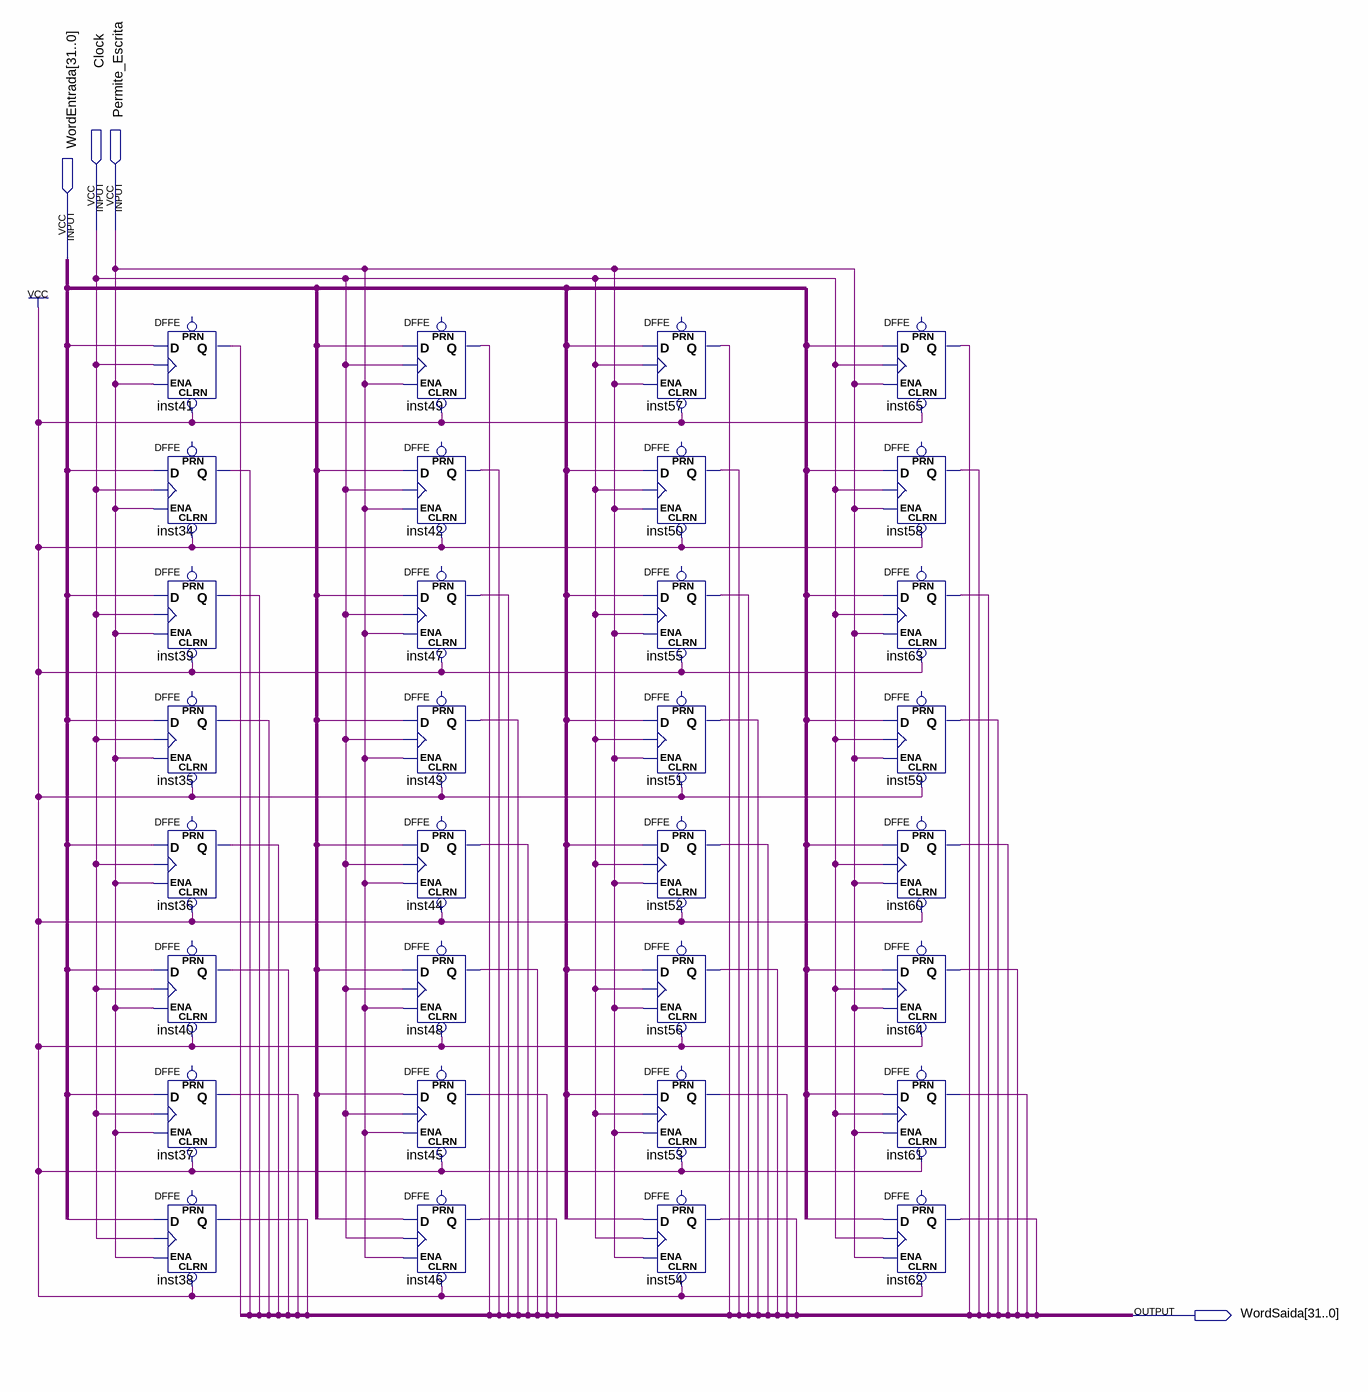
[diagram p0: schematic sheet]
// Quartus schematic registrador32.bdf as structural Verilog: 32 symbols, 4 pins
module registrador32 (
  input  Clock,
  input  Permite_Escrita,
  input  [31:0] WordEntrada,
  output [31:0] WordSaida
);

  DFFE inst41 (.CLRN(1'b1), .D(WordEntrada[0]), .CLK(Clock), .ENA(Permite_Escrita), .Q(WordSaida[0]));  // open: PRN
  DFFE inst34 (.CLRN(1'b1), .D(WordEntrada[1]), .CLK(Clock), .ENA(Permite_Escrita), .Q(WordSaida[1]));  // open: PRN
  DFFE inst39 (.CLRN(1'b1), .D(WordEntrada[2]), .CLK(Clock), .ENA(Permite_Escrita), .Q(WordSaida[2]));  // open: PRN
  DFFE inst35 (.CLRN(1'b1), .D(WordEntrada[3]), .CLK(Clock), .ENA(Permite_Escrita), .Q(WordSaida[3]));  // open: PRN
  DFFE inst36 (.CLRN(1'b1), .D(WordEntrada[4]), .CLK(Clock), .ENA(Permite_Escrita), .Q(WordSaida[4]));  // open: PRN
  DFFE inst40 (.CLRN(1'b1), .D(WordEntrada[5]), .CLK(Clock), .ENA(Permite_Escrita), .Q(WordSaida[5]));  // open: PRN
  DFFE inst37 (.CLRN(1'b1), .D(WordEntrada[6]), .CLK(Clock), .ENA(Permite_Escrita), .Q(WordSaida[6]));  // open: PRN
  DFFE inst38 (.CLRN(1'b1), .D(WordEntrada[7]), .CLK(Clock), .ENA(Permite_Escrita), .Q(WordSaida[7]));  // open: PRN
  DFFE inst49 (.CLRN(1'b1), .D(WordEntrada[8]), .CLK(Clock), .ENA(Permite_Escrita), .Q(WordSaida[8]));  // open: PRN
  DFFE inst42 (.CLRN(1'b1), .D(WordEntrada[9]), .CLK(Clock), .ENA(Permite_Escrita), .Q(WordSaida[9]));  // open: PRN
  DFFE inst47 (.CLRN(1'b1), .D(WordEntrada[10]), .CLK(Clock), .ENA(Permite_Escrita), .Q(WordSaida[10]));  // open: PRN
  DFFE inst43 (.CLRN(1'b1), .D(WordEntrada[11]), .CLK(Clock), .ENA(Permite_Escrita), .Q(WordSaida[11]));  // open: PRN
  DFFE inst44 (.CLRN(1'b1), .D(WordEntrada[12]), .CLK(Clock), .ENA(Permite_Escrita), .Q(WordSaida[12]));  // open: PRN
  DFFE inst48 (.CLRN(1'b1), .D(WordEntrada[13]), .CLK(Clock), .ENA(Permite_Escrita), .Q(WordSaida[13]));  // open: PRN
  DFFE inst45 (.CLRN(1'b1), .D(WordEntrada[14]), .CLK(Clock), .ENA(Permite_Escrita), .Q(WordSaida[14]));  // open: PRN
  DFFE inst46 (.CLRN(1'b1), .D(WordEntrada[15]), .CLK(Clock), .ENA(Permite_Escrita), .Q(WordSaida[15]));  // open: PRN
  DFFE inst57 (.CLRN(1'b1), .D(WordEntrada[16]), .CLK(Clock), .ENA(Permite_Escrita), .Q(WordSaida[16]));  // open: PRN
  DFFE inst50 (.CLRN(1'b1), .D(WordEntrada[17]), .CLK(Clock), .ENA(Permite_Escrita), .Q(WordSaida[17]));  // open: PRN
  DFFE inst55 (.CLRN(1'b1), .D(WordEntrada[18]), .CLK(Clock), .ENA(Permite_Escrita), .Q(WordSaida[18]));  // open: PRN
  DFFE inst51 (.CLRN(1'b1), .D(WordEntrada[19]), .CLK(Clock), .ENA(Permite_Escrita), .Q(WordSaida[19]));  // open: PRN
  DFFE inst52 (.CLRN(1'b1), .D(WordEntrada[20]), .CLK(Clock), .ENA(Permite_Escrita), .Q(WordSaida[20]));  // open: PRN
  DFFE inst56 (.CLRN(1'b1), .D(WordEntrada[21]), .CLK(Clock), .ENA(Permite_Escrita), .Q(WordSaida[21]));  // open: PRN
  DFFE inst53 (.CLRN(1'b1), .D(WordEntrada[22]), .CLK(Clock), .ENA(Permite_Escrita), .Q(WordSaida[22]));  // open: PRN
  DFFE inst54 (.CLRN(1'b1), .D(WordEntrada[23]), .CLK(Clock), .ENA(Permite_Escrita), .Q(WordSaida[23]));  // open: PRN
  DFFE inst65 (.CLRN(1'b1), .D(WordEntrada[24]), .CLK(Clock), .ENA(Permite_Escrita), .Q(WordSaida[24]));  // open: PRN
  DFFE inst58 (.CLRN(1'b1), .D(WordEntrada[25]), .CLK(Clock), .ENA(Permite_Escrita), .Q(WordSaida[25]));  // open: PRN
  DFFE inst63 (.CLRN(1'b1), .D(WordEntrada[26]), .CLK(Clock), .ENA(Permite_Escrita), .Q(WordSaida[26]));  // open: PRN
  DFFE inst59 (.CLRN(1'b1), .D(WordEntrada[27]), .CLK(Clock), .ENA(Permite_Escrita), .Q(WordSaida[27]));  // open: PRN
  DFFE inst60 (.CLRN(1'b1), .D(WordEntrada[28]), .CLK(Clock), .ENA(Permite_Escrita), .Q(WordSaida[28]));  // open: PRN
  DFFE inst64 (.CLRN(1'b1), .D(WordEntrada[29]), .CLK(Clock), .ENA(Permite_Escrita), .Q(WordSaida[29]));  // open: PRN
  DFFE inst61 (.CLRN(1'b1), .D(WordEntrada[30]), .CLK(Clock), .ENA(Permite_Escrita), .Q(WordSaida[30]));  // open: PRN
  DFFE inst62 (.CLRN(1'b1), .D(WordEntrada[31]), .CLK(Clock), .ENA(Permite_Escrita), .Q(WordSaida[31]));  // open: PRN
endmodule
